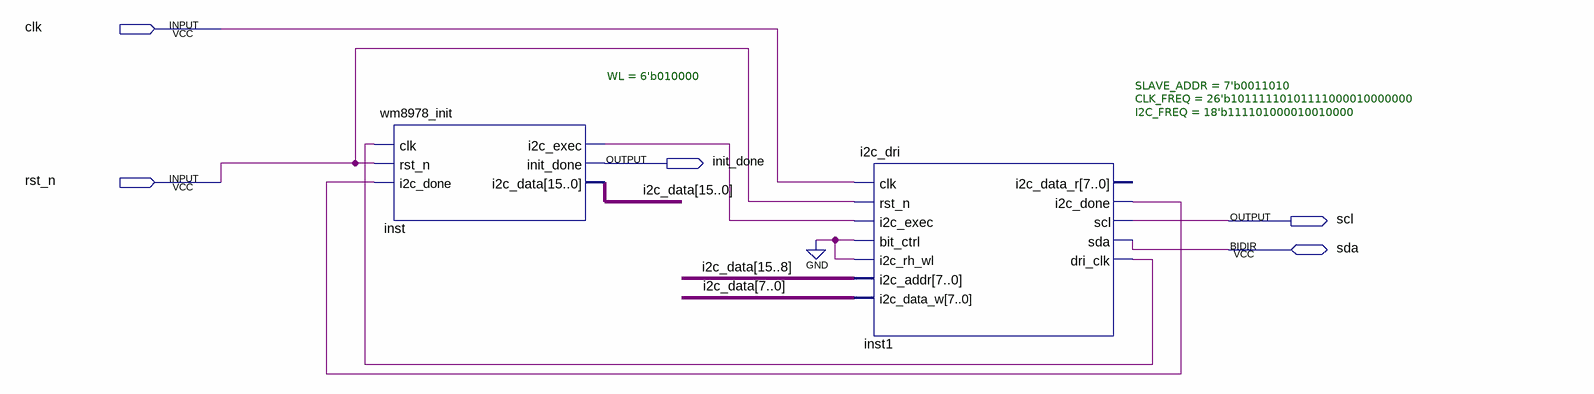
[diagram p0: schematic sheet]
// Quartus schematic wm8978_on.bdf as structural Verilog: 2 symbols, 5 pins
module wm8978_on (
  input  clk,
  input  rst_n,
  inout  sda,
  output init_done,
  output scl
);

  wire inst1_dri_clk, inst1_i2c_done, inst_i2c_exec;
  wire [15:0] i2c_data;

  wm8978_init #(.WL(6'b010000)) inst (
    .clk(inst1_dri_clk), .rst_n(rst_n), .i2c_done(inst1_i2c_done), .i2c_exec(inst_i2c_exec),
    .init_done(init_done), .i2c_data(i2c_data));
  i2c_dri #(.SLAVE_ADDR(7'b0011010), .CLK_FREQ(26'b10111110101111000010000000), .I2C_FREQ(18'b111101000010010000)) inst1 (
    .clk(clk), .rst_n(rst_n), .i2c_exec(inst_i2c_exec), .bit_ctrl(1'b0), .i2c_rh_wl(1'b0),
    .i2c_addr(i2c_data[15:8]), .i2c_data_w(i2c_data[7:0]), .i2c_done(inst1_i2c_done), .scl(scl),
    .dri_clk(inst1_dri_clk), .sda(sda));  // open: i2c_data_r
endmodule
